# EAGLE design module_buzzer (EAGLE 7.1.0)
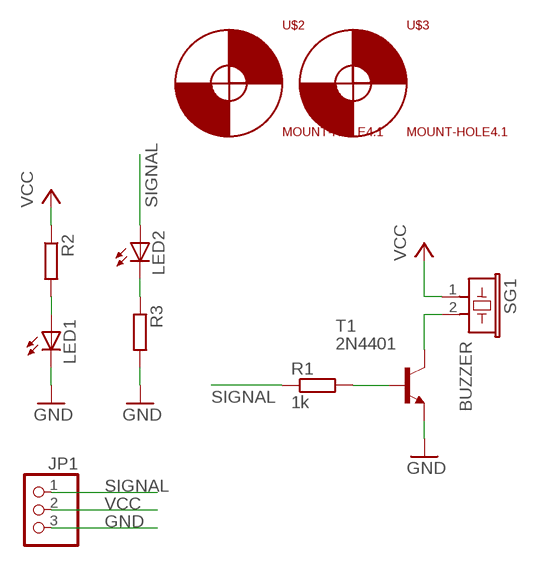
[diagram p0: schematic, sheet 1]

## Parts
JP1  PINHD-1X3  [1X03]
LED1  LED5MM  [LED5MM]
LED2  LED5MM  [LED5MM]
R1  1k  R-EU_0207_7  [0207/7]
R2  R-EU_0207_7  [0207/7]
R3  R-EU_0207_7  [0207/7]
SG1  BUZZER  [BUZZER-HCM1212A]
T1  2N4401  [TO92-CBE]
U$2  MOUNT-HOLE4.1  [4.1]
U$3  MOUNT-HOLE4.1  [4.1]

## Nets
GND: JP1.3 LED1.K(C) R3.2 T1.E
N$1: LED1.A R2.2
N$2: R1.2 T1.B
N$3: SG1.2 T1.C
N$4: LED2.K(C) R3.1
SIGNAL: JP1.1 LED2.A R1.1
VCC: JP1.2 R2.1 SG1.1

## Library data of the parts
JP1 = robocraft:PINHD-1X3: PIN HEADER
LED1 LED2 = led:LED: LED OSRAM: - CHIPLED LG R971, LG N971, LY N971, LG Q971, LY Q971, LO R971, LY R971 LH N974, LH R974 LS Q976, LO Q976, LY Q976 LO Q996 - Hyper CHIPLED LW Q18S LB Q993, LB Q99A, LB R99A - SideLED LS A670, LO A670, LY A670, LG A670, LP A670 LB A673, LV A673, LT A673, LW A673 LH A674 LY A675 LS A676, LA A676, LO A676, LY A676, LW A676 LS A679, LY A679, LG A679 - Hyper Micro SIDELED® LS Y876, LA Y876, LO Y876, LY Y876 LT Y87S - SmartLED LW L88C, LW L88S LB L89C, LB L89S, LG L890 LS L89K, LO L89K, LY L89K LS L896, LA L896, LO L896, LY L896 - TOPLED LS T670, LO T670, LY T670, LG T670, LP T670 LSG T670, LSP T670, LSY T670, LOP T670, LYG T670 LG T671, LOG T671, LSG T671 LB T673, LV T673, LT T673, LW T673 LH T674 LS T676, LA T676, LO T676, LY T676, LB T676, LH T676, LSB T676, LW T676 LB T67C, LV T67C, LT T67C, LS T67K, LO T67K, LY T67K, LW E67C LS E67B, LA E67B, LO E67B, LY E67B, LB E67C, LV E67C, LT E67C LW T67C LS T679, LY T679, LG T679 LS T770, LO T770, LY T770, LG T770, LP T770 LB T773, LV T773, LT T773, LW T773 LH T774 LS E675, LA E675, LY E675, LS T675 LS T776, LA T776, LO T776, LY T776, LB T776 LHGB T686 LT T68C, LB T68C - Hyper Mini TOPLED® LB M676 - Mini TOPLED Santana® LG M470 LS M47K, LO M47K, LY M47K Source: http://www.osram.convergy.de LUXEON: - LUMILED® LXK2-PW12-R00, LXK2-PW12-S00, LXK2-PW14-U00, LXK2-PW14-V00 LXK2-PM12-R00, LXK2-PM12-S00, LXK2-PM14-U00 LXK2-PE12-Q00, LXK2-PE12-R00, LXK2-PE12-S00, LXK2-PE14-T00, LXK2-PE14-U00 LXK2-PB12-K00, LXK2-PB12-L00, LXK2-PB12-M00, LXK2-PB14-N00, LXK2-PB14-P00, LXK2-PB14-Q00 LXK2-PR12-L00, LXK2-PR12-M00, LXK2-PR14-Q00, LXK2-PR14-R00 LXK2-PD12-Q00, LXK2-PD12-R00, LXK2-PD12-S00 LXK2-PH12-R00, LXK2-PH12-S00 LXK2-PL12-P00, LXK2-PL12-Q00, LXK2-PL12-R00 Source: www.luxeon.com KINGBRIGHT: KA-3528ASYC Source: www.kingbright.com
R1-R3 = resistor:R-EU_: RESISTOR, European symbol; SPICEPREFIX: R
SG1 = robocraft:BUZZER: BUZZER
T1 = robocraft:2N4401: NPN TRANSISTOR
U$2 U$3 = robocraft:MOUNT-HOLE: Mount hole

## Board
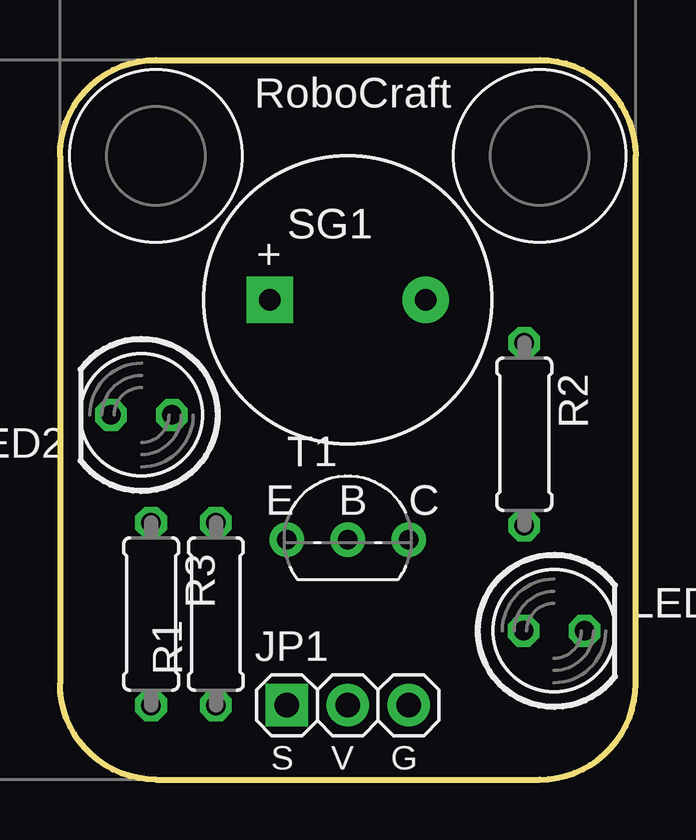
[diagram p1: board, top side]
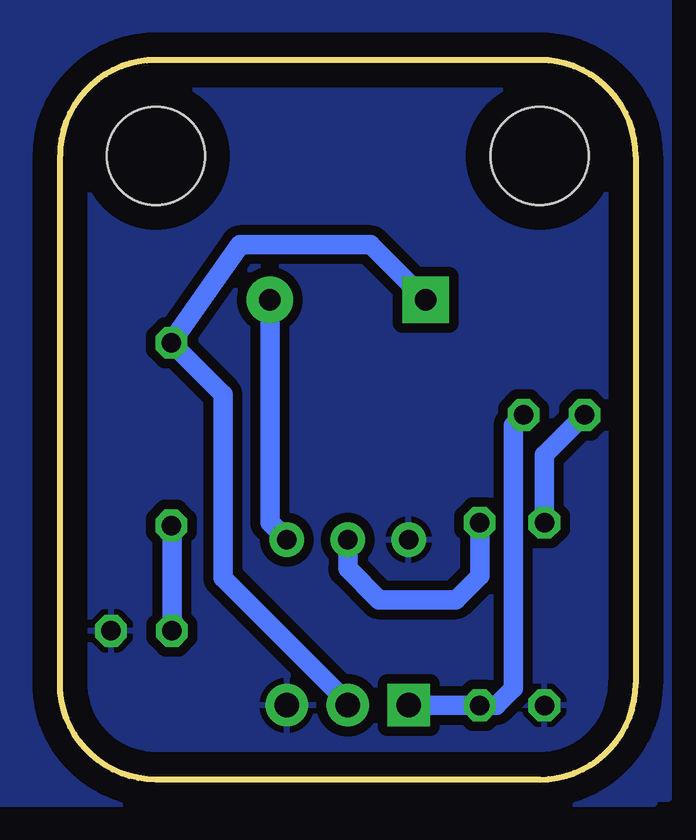
[diagram p2: board, bottom side, seen from below]

Size 24 x 30 mm. Coordinates in mm from the lower left corner, seen from the top.
Outline: 4,0 20,0 arc90 24,4 24,26 arc90 20,30 4,30 arc90 0,26 0,4 arc90 4,0
Copper layers (1*16): Top 0.035mm / dielectric 1.5mm / Bottom 0.035mm
Design rules "default": minimum track width 10mil, minimum drill 24mil, track to track 8mil, track to pad 8mil, pad to pad 8mil, via to via 8mil, smd to smd 8mil, copper to edge 40mil, drill to drill 8mil, minimum pad ring 10mil, minimum via ring 8mil, stop-mask expansion 4mil, vias tented up to drill 0mil, thermal gap 10mil

### Footprints (pad centres in the part's own frame; a part is rotated, then mirrored left to right if it is on the bottom)
1X03 = drill 1.016 pad 1.778 square: 1 -2.54,0 | drill 1.016 pad 1.778: 2 0,0; 3 2.54,0
LED5MM = drill 0.813 octagon: A -1.27,0; K 1.27,0
0207/7 = drill 0.813 octagon: 1 -3.81,0; 2 3.81,0
BUZZER-HCM1212A = drill 0.9 pad 1.93 square: 1 -3.25,0 | drill 0.9 pad 1.93: 2 3.25,0
TO92-CBE = drill 0.813 pad 1.422: B 0,0; C 2.54,0; E -2.54,0
4.1 = hole 4.1: 0,0

### Placement (x,y rotation side)
JP1  12,3.1 0 top
LED1  20.6,6.2 0 top
LED2  3.4,15.2 180 top
R1  6.5,6.9 90 top
R2  19.36,14.4 270 top
R3  3.8,6.9 270 top
SG1  12,20 0 top
T1  12,10 0 top
U$2  4,26 0 top
U$3  20,26 0 top

### Tracks (layer width: path | path; a pad name or v marks a point on that pad's centre or on a via)
GND
  pour Bottom (isolate 0.406): -1.4,36 26.6,36 26.6,-1 -0.8,-1 -0.8,-0.8 -1.4,-0.8
N$1
  Bottom 0.813: LED1.A 19.33,10.56 R2.2
N$2
  Bottom 0.813: T1.B 12,8.8 10.7,7.5 7.5,7.5 6.5,8.5 R1.2
N$3
  Bottom 0.813: T1.C 15.25,10.71 SG1.2
N$4
  Bottom 0.813: R3.1 3.8,13.53 LED2.K
SIGNAL
  Bottom 0.813: JP1.1 R1.1 5.81,3.09 5.1,3.8 5.1,14.77 LED2.A
VCC
  Bottom 0.813: SG1.1 11.05,22.3 16.5,22.3 R2.1 17.2,16.05 17.2,8.4 12,3.2 JP1.2

### Text on the board
tPlace: RoboCraft | S | V | G